# EAGLE design G228H (EAGLE 6.6.0)
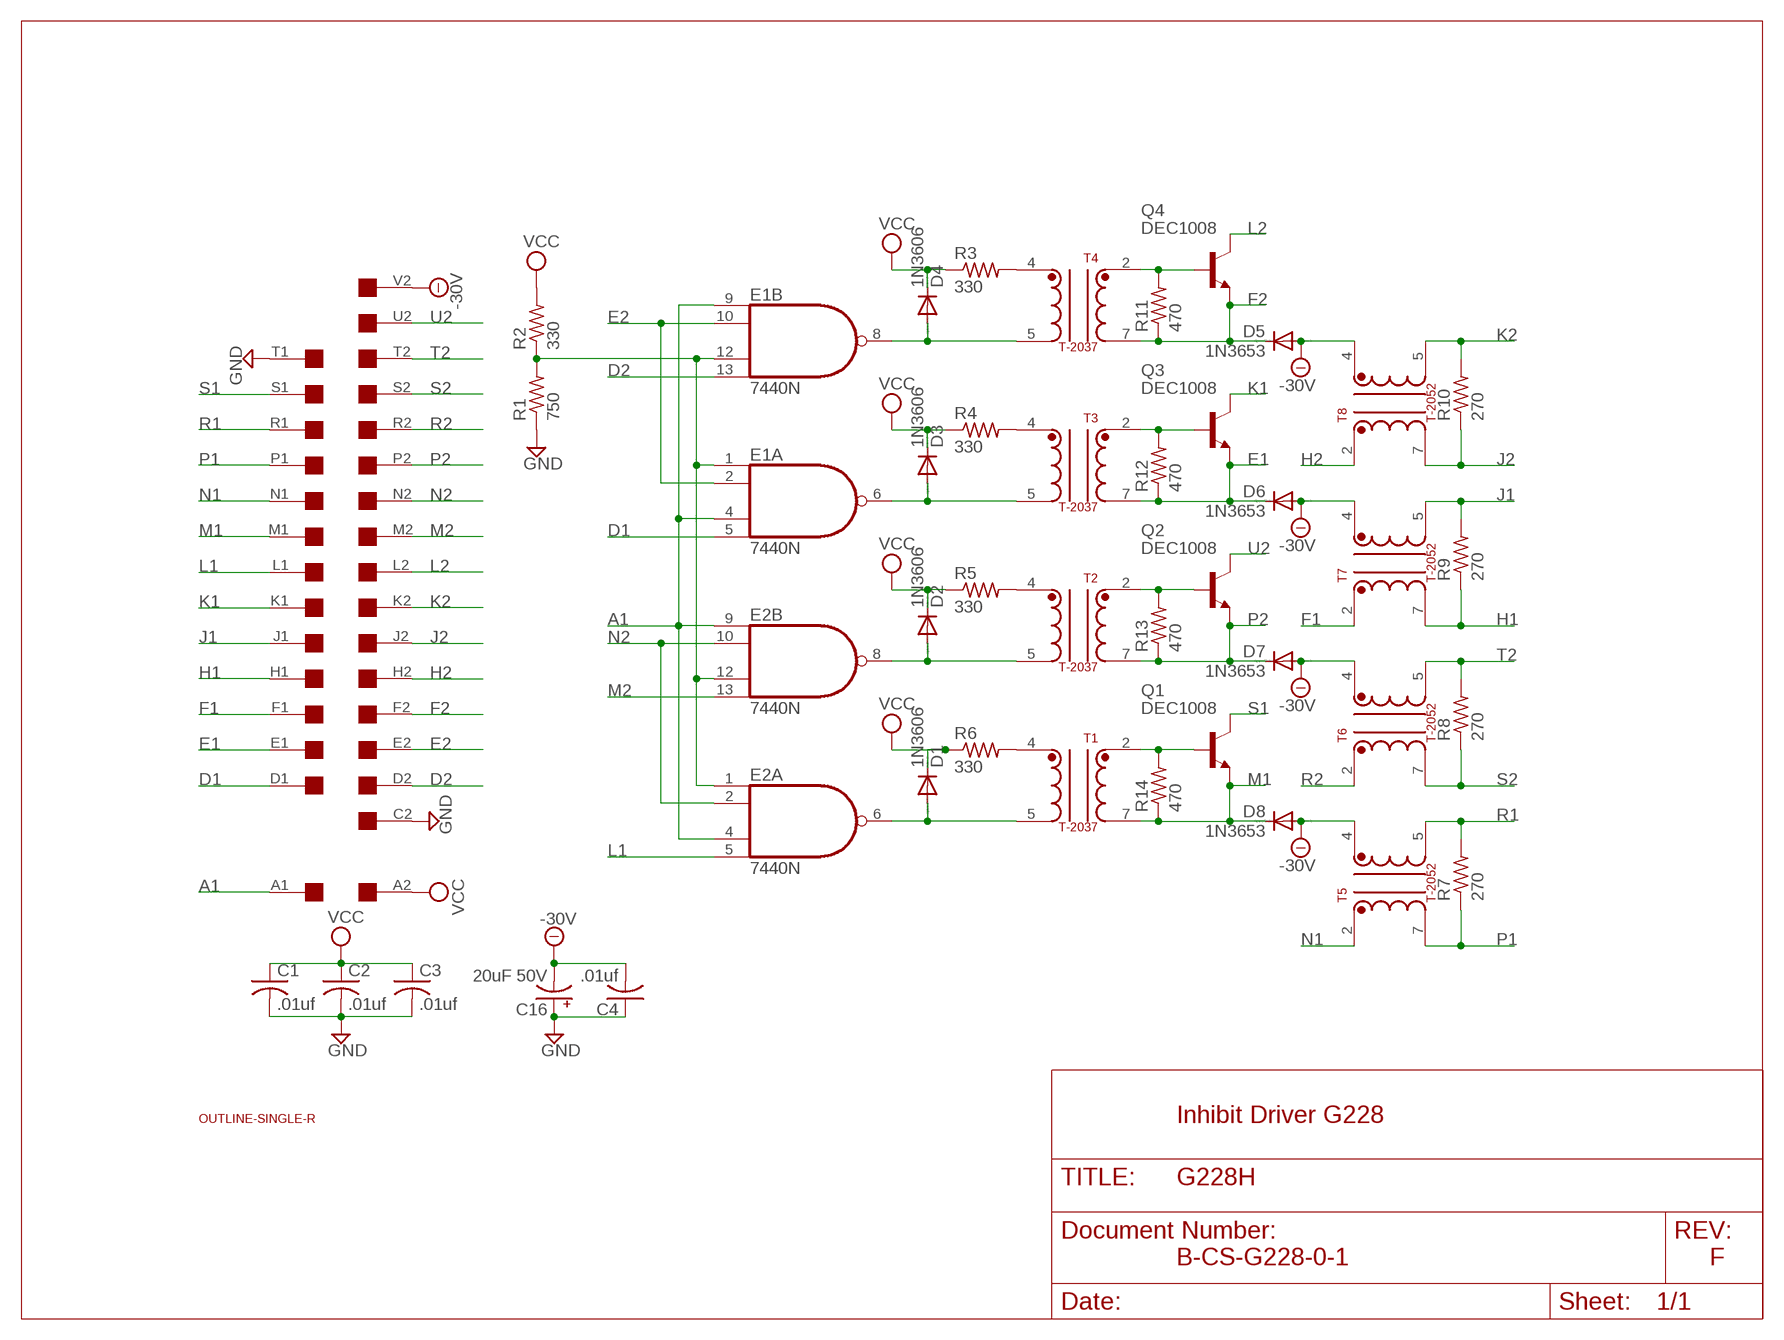
[diagram p0: schematic, sheet 1]

## Parts
C1  .01uf  C-US050-025X075  [C050-025X075]
C2  .01uf  C-US050-025X075  [C050-025X075]
C3  .01uf  C-US050-025X075  [C050-025X075]
C4  .01uf  C-US050-025X075  [C050-025X075]
C16  20uF 50V  CPOL-USE28-8AXIAL  [E28-8]
D1  1N3606  1N4148DO35-10  [DO35-10]
D2  1N3606  1N4148DO35-10  [DO35-10]
D3  1N3606  1N4148DO35-10  [DO35-10]
D4  1N3606  1N4148DO35-10  [DO35-10]
D5  1N3653  1N4148DO35-10  [DO35-10]
D6  1N3653  1N4148DO35-10  [DO35-10]
D7  1N3653  1N4148DO35-10  [DO35-10]
D8  1N3653  1N4148DO35-10  [DO35-10]
E1  7440N  74S20N  [DIL14]
E2  7440N  74S20N  [DIL14]
Q1  DEC1008  2N1613-NPN-TO39-EBC  [TO39]
Q2  DEC1008  2N1613-NPN-TO39-EBC  [TO39]
Q3  DEC1008  2N1613-NPN-TO39-EBC  [TO39]
Q4  DEC1008  2N1613-NPN-TO39-EBC  [TO39]
R1  750  R-US_0207/10  [0207/10]
R2  330  R-US_0207/10  [0207/10]
R3  330  R-US_0207/10  [0207/10]
R4  330  R-US_0207/10  [0207/10]
R5  330  R-US_0207/10  [0207/10]
R6  330  R-US_0207/10  [0207/10]
R7  270  R-US_0207/10  [0207/10]
R8  270  R-US_0207/10  [0207/10]
R9  270  R-US_0207/10  [0207/10]
R10  270  R-US_0207/10  [0207/10]
R11  470  R-US_0207/10  [0207/10]
R12  470  R-US_0207/10  [0207/10]
R13  470  R-US_0207/10  [0207/10]
R14  470  R-US_0207/10  [0207/10]
T1  T-2037  [TRANSFORMER]
T2  T-2037  [TRANSFORMER]
T3  T-2037  [TRANSFORMER]
T4  T-2037  [TRANSFORMER]
T5  T-2052  [TRANSFORMER]
T6  T-2052  [TRANSFORMER]
T7  T-2052  [TRANSFORMER]
T8  T-2052  [TRANSFORMER]
U$1  SINGLE  [EDGE-CON2]
U$2  OUTLINE-SINGLE-R  [SINGLE-R]

## Nets
-24V [supply]: C4.2 C16.- D5.A D6.A D7.A D8.A T5.4 T6.4 T7.4 T8.4 U$1.V2 ; supply symbol labelled -30V
A1: E1.4(A:I2) E1.9(B:I0) E2.4(A:I2) E2.9(B:I0) U$1.A1
D1: E1.5(A:I3) U$1.D1
D2: E1.13(B:I3) U$1.D2
E1: D6.C Q3.1(E) R12.1 T3.7 U$1.E1
E2: E1.2(A:I1) E1.10(B:I1) U$1.E2
F1: T7.2 U$1.F1
F2: D5.C Q4.1(E) R11.1 T4.7 U$1.F2
GND [supply]: C1.2 C2.2 C3.2 C4.1 C16.+ R1.1 U$1.C2 U$1.T1
H1: R9.1 T7.7 U$1.H1
H2: T8.2 U$1.H2
J1: R9.2 T7.5 U$1.J1
J2: R10.1 T8.7 U$1.J2
K1: Q3.3(C) U$1.K1
K2: R10.2 T8.5 U$1.K2
L1: E2.5(A:I3) U$1.L1
L2: Q4.3(C) U$1.L2
M1: D8.C Q1.1(E) R14.1 T1.7 U$1.M1
M2: E2.13(B:I3) U$1.M2
N1: T5.2 U$1.N1
N2: E2.2(A:I1) E2.10(B:I1) U$1.N2
N$1: E1.1(A:I0) E1.12(B:I2) E2.1(A:I0) E2.12(B:I2) R1.2 R2.1
N$2: D1.A E2.6(A:O) T1.5
N$3: D2.A E2.8(B:O) T2.5
N$4: D3.A E1.6(A:O) T3.5
N$5: D4.A E1.8(B:O) T4.5
N$6: R6.2 T1.4
N$7: R5.2 T2.4
N$8: R4.2 T3.4
N$9: R3.2 T4.4
N$10: Q4.2(B) R11.2 T4.2
N$12: Q3.2(B) R12.2 T3.2
N$14: Q2.2(B) R13.2 T2.2
N$16: Q1.2(B) R14.2 T1.2
P1: R7.1 T5.7 U$1.P1
P2: D7.C Q2.1(E) R13.1 T2.7 U$1.P2
R1: R7.2 T5.5 U$1.R1
R2: T6.2 U$1.R2
S1: Q1.3(C) U$1.S1
S2: R8.1 T6.7 U$1.S2
T2: R8.2 T6.5 U$1.T2
U2: Q2.3(C) U$1.U2
VCC [supply]: C1.1 C2.1 C3.1 D1.C D2.C D3.C D4.C R2.2 R3.1 R4.1 R5.1 R6.1 U$1.A2
Unconnected: U$1.B1 U$1.B2 U$1.C1 U$1.U1 U$1.V1

## Notes on the sheet
- Inhibit Driver G228
- B-CS-G228-0-1 | F

## Power pins joined to a net without a drawn wire
GND: E1.7(P:GND) E2.7(P:GND)
VCC: E1.14(P:VCC) E2.14(P:VCC)

## Library data of the parts
C1-C4 = rcl:C-US: CAPACITOR, American symbol
C16 = dec-con:CPOL-USE28-8AXIAL: Large Electrolytic, grin 1.1"
D1-D8 = diode:1N4148: DIODE high speed (Philips)
E1 E2 = 74xx-us:74*20: Dual 4-input NAND gate
Q1-Q4 = transistor:*-NPN-: NPN Transistror BF959 corrected 2008.03.06
R1-R14 = rcl:R-US_: RESISTOR, American symbol
T1-T4 = dec-con:T-2037: T-2037 Transformer
T5-T8 = dec-con:T-2052: T-2052 Transformer
U$1 = dec-con:SINGLE: Single-Height DEC board
U$2 = dec-con:OUTLINE-*: Board outlines for DEC boards.

## Net classes
1 supply: width 0.813 mm

## Board
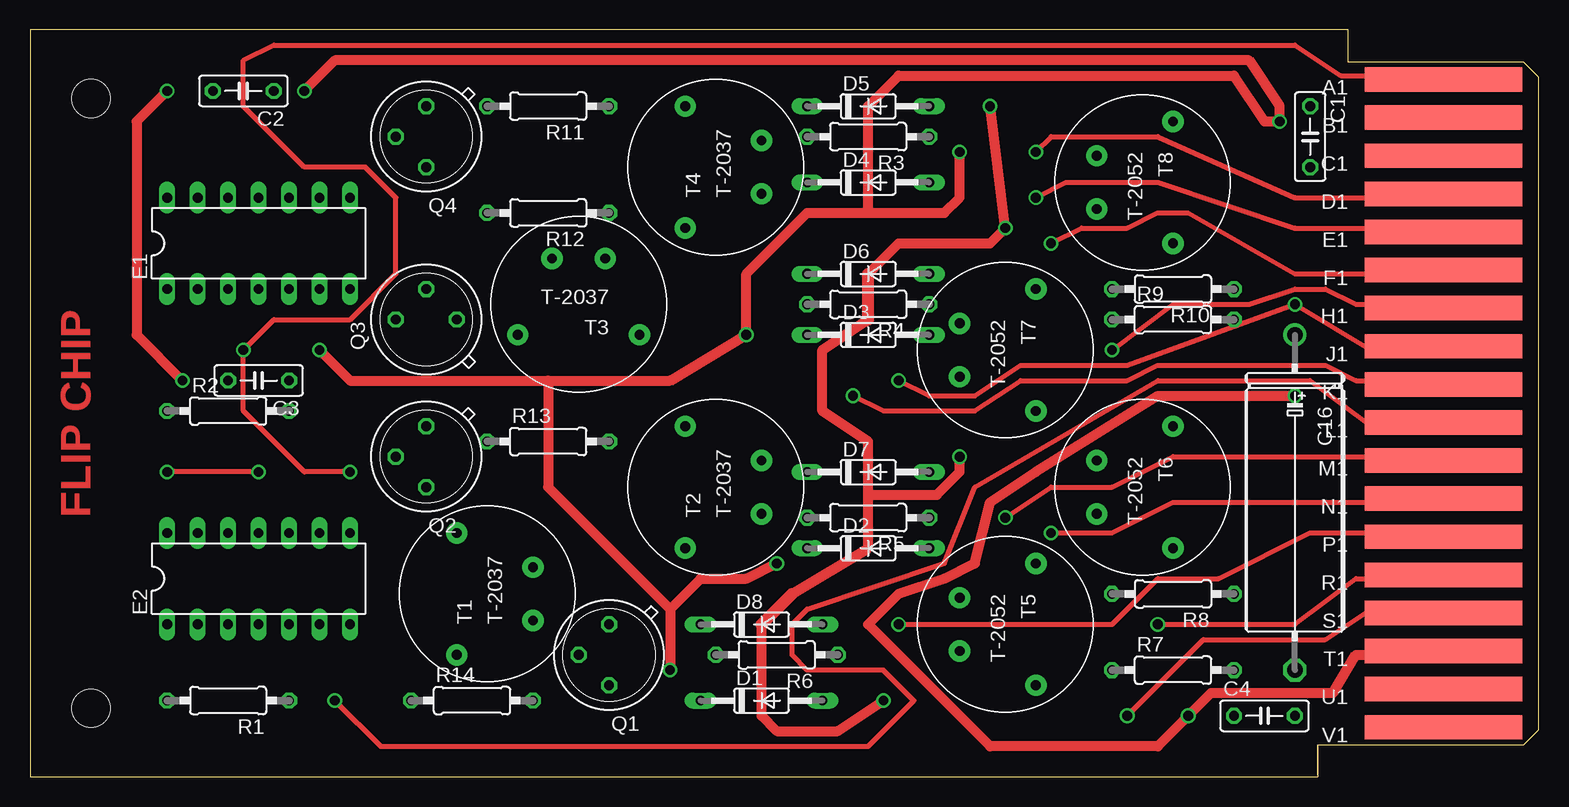
[diagram p1: board, top side]
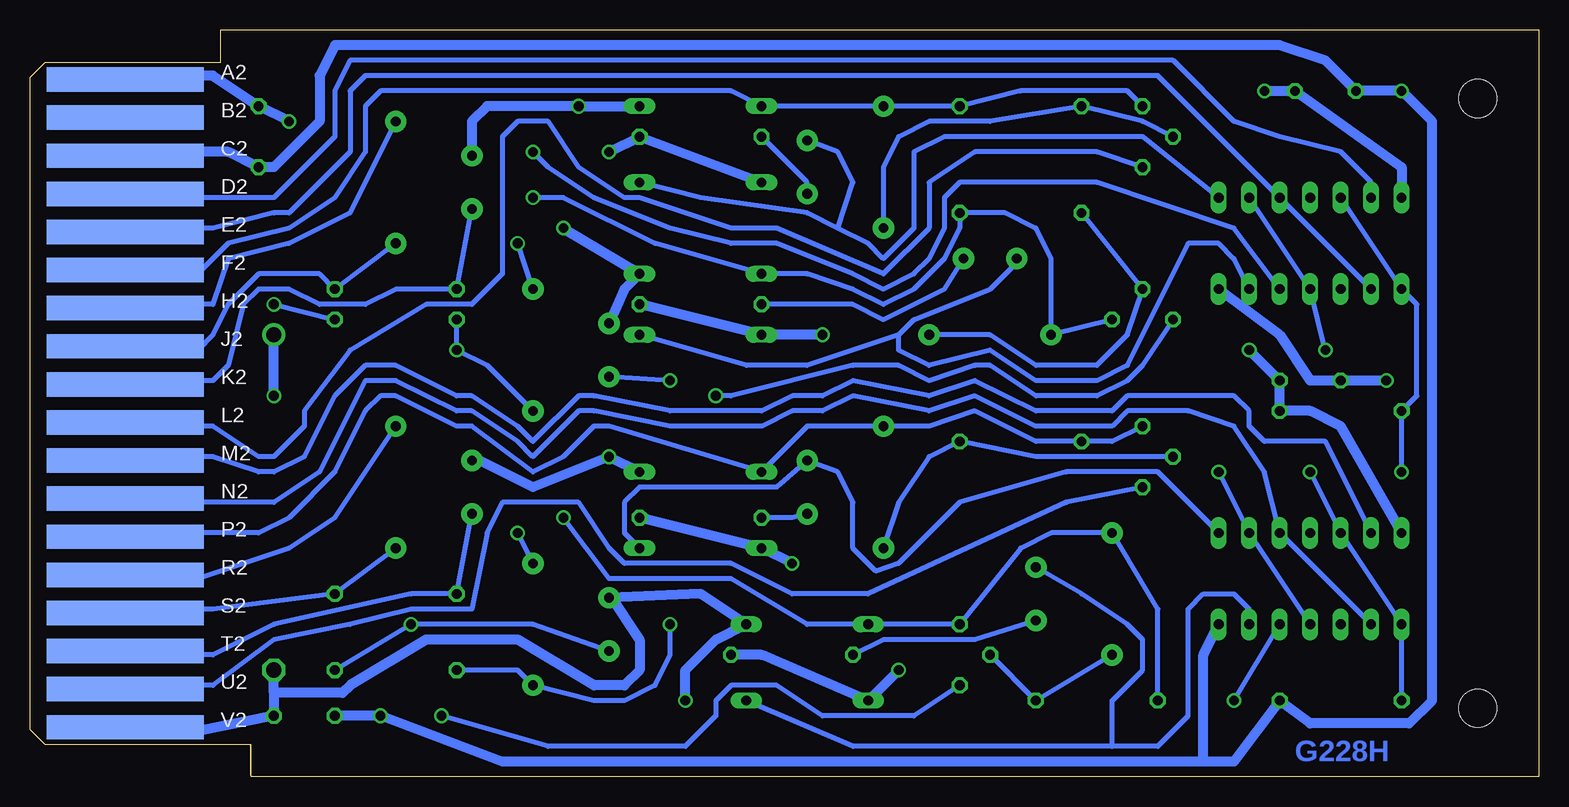
[diagram p2: board, bottom side, seen from below]

Size 125.73 x 62.23 mm. Coordinates in mm from the lower left corner, seen from the top.
Copper layers (1+16): Top 0.035mm / dielectric 1.5mm / Bottom 0.035mm
Design rules "16mils": minimum track width 16mil, minimum drill 32mil, track to track 15mil, track to pad 10mil, pad to pad 10mil, via to via 10mil, smd to smd 10mil, copper to edge 13mil, drill to drill 10mil, minimum pad ring 10mil, minimum via ring 8mil, stop-mask expansion 0mil, vias tented up to drill 0mil, thermal gap 10mil

### Footprints (pad centres in the part's own frame; a part is rotated, then mirrored left to right if it is on the bottom)
C050-025X075 = drill 0.813 octagon: 1 -2.54,0; 2 2.54,0
E28-8 = drill 1.27: + -13.97,0 | drill 1.27 octagon: - 13.97,0
DO35-10 = drill 0.813 long: A 5.08,0; C -5.08,0
DIL14 = drill 0.813 long: 1 -7.62,-3.81; 2 -5.08,-3.81; 3 -2.54,-3.81; 4 0,-3.81; 5 2.54,-3.81; 6 5.08,-3.81; 7 7.62,-3.81; 8 7.62,3.81; 9 5.08,3.81; 10 2.54,3.81; 11 0,3.81; 12 -2.54,3.81; 13 -5.08,3.81; 14 -7.62,3.81
TO39 = drill 0.813 octagon: 1 0,-2.54; 2 2.54,0; 3 0,2.54
0207/10 = drill 0.813 octagon: 1 -5.08,0; 2 5.08,0
TRANSFORMER = drill 0.813 pad 1.778: 2 -5.08,2.54; 4 -2.223,-3.81; 5 2.223,-3.81; 7 5.08,2.54
EDGE-CON2 = smd 13.106 x 2.032: A1 7.938,4.128; B1 7.938,7.303; C1 7.938,10.477; D1 7.938,13.652; E1 7.938,16.828; F1 7.938,20.003; H1 7.938,23.177; J1 7.938,26.352; K1 7.938,29.527; L1 7.938,32.703; M1 7.938,35.877; N1 7.938,39.053; P1 7.938,42.227; R1 7.938,45.403; S1 7.938,48.578; T1 7.938,51.752; U1 7.938,54.928; V1 7.938,58.102 | smd 13.106 x 2.032 bottom: A2 7.938,4.128; B2 7.938,7.303; C2 7.938,10.477; D2 7.938,13.652; E2 7.938,16.828; F2 7.938,20.003; H2 7.938,23.177; J2 7.938,26.352; K2 7.938,29.527; L2 7.938,32.703; M2 7.938,35.877; N2 7.938,39.053; P2 7.938,42.227; R2 7.938,45.403; S2 7.938,48.578; T2 7.938,51.752; U2 7.938,54.928; V2 7.938,58.102
SINGLE-R = hole 3.175: 5.08,5.715; 5.08,56.515

### Placement (x,y rotation side)
C1  106.68,53.34 270 top
C2  17.78,57.15 180 top
C3  19.05,33.02 180 top
C4  102.87,5.08 0 top
C16  105.41,22.86 270 top
D1  60.96,6.35 0 top
D2  69.85,19.05 0 top
D3  69.85,36.83 0 top
D4  69.85,49.53 0 top
D5  69.85,55.88 0 top
D6  69.85,41.91 0 top
D7  69.85,25.4 0 top
D8  60.96,12.7 0 top
E1  19.05,44.45 0 top
E2  19.05,16.51 0 top
Q1  48.26,10.16 180 top
Q2  33.02,26.67 180 top
Q3  33.02,38.1 90 top
Q4  33.02,53.34 180 top
R1  16.51,6.35 180 top
R2  16.51,30.48 0 top
R3  69.85,53.34 180 top
R4  69.85,39.37 180 top
R5  69.85,21.59 180 top
R6  62.23,10.16 180 top
R7  95.25,8.89 0 top
R8  95.25,15.24 180 top
R9  95.25,38.1 0 top
R10  95.25,40.64 180 top
R11  43.18,55.88 180 top
R12  43.18,46.99 180 top
R13  43.18,27.94 0 top
R14  36.83,6.35 0 top
T1  38.1,15.24 90 top
T2  57.15,24.13 90 top
T3  45.72,39.37 180 top
T4  57.15,50.8 90 top
T5  81.28,12.7 270 top
T6  92.71,24.13 270 top
T7  81.28,35.56 270 top
T8  92.71,49.53 270 top
U$1  125.73,62.23 180 top
U$2  0,0 0 top

### Tracks (layer width: path | path; a pad name or v marks a point on that pad's centre or on a via)
-24V  (via drill 0.81)
  Top 0.813: v80.01,55.88 v81.28,45.72 80.01,44.45 72.39,44.45 69.85,41.91 | v71.12,6.35 67.31,3.81 62.23,3.81 60.96,5.08 60.96,12.7 | 63.5,15.24 69.85,19.05 69.85,23.5 | 69.85,23.5 69.85,27.94 66.04,30.48 66.04,35.56 69.85,38.1 | v77.47,26.67 77.47,25.4 75.56,23.5 69.85,23.5
  Top 1.016: 60.96,12.7 63.5,15.24 | 69.85,38.1 69.85,41.91
  Bottom 0.813: U$1.V2 115.57,3.81 111.76,3.81 C4.2 105.41,6.99 | 105.41,6.99 C16.- | 105.41,6.99 99.69,6.99 99.06,7.62 92.71,11.43 85.09,11.43 78.74,7.62 76.2,7.62 74.93,8.89 74.93,11.43 77.47,15.24 T5.4 69.85,15.24 D8.A 68.58,11.43 71.12,8.89 v71.12,6.35 | D5.A v80.01,55.88 87.63,55.88 88.9,54.61 T8.4 | T7.4 76.2,40.64 D6.A v81.28,45.72 | D7.A v77.47,26.67 83.82,24.13 88.9,26.67 T6.4
A1  (via drill 0.81)
  Top 0.406: U$1.A1 115.57,58.42 109.22,58.42 105.41,60.96 20.32,60.96 17.78,59.69 17.78,55.88 22.86,50.8 27.94,50.8 30.48,48.26 30.48,41.91 26.67,38.1 20.32,38.1 v17.78,35.56 17.78,30.48 22.86,25.4 v26.67,25.4
  Bottom 0.406: E2.4 E2.9 v26.67,25.4 | v17.78,35.56 E1.4 E1.9
D1  (via drill 0.81)
  Top 0.406: U$1.D1 115.57,48.26 105.41,48.26 93.98,53.34 85.09,53.34 v83.82,52.07
  Bottom 0.406: E1.5 25.4,45.72 36.83,49.53 48.26,49.53 49.53,48.26 49.53,45.72 50.8,43.18 52.07,41.91 54.61,40.64 57.15,41.91 63.5,44.45 67.31,44.45 72.39,45.72 78.74,48.26 82.55,50.8 v83.82,52.07
D2
  Bottom 0.406: E1.13 13.97,49.53 16.51,52.07 21.59,53.34 25.4,54.61 30.48,59.69 99.06,59.69 100.33,57.15 100.33,53.34 105.41,48.26 115.57,48.26 U$1.D2
E1  (via drill 0.81)
  Top 0.406: v83.82,48.26 86.36,49.53 93.98,49.53 105.41,45.72 115.57,45.72 U$1.E1
  Bottom 0.406: Q3.1 T3.7 40.64,43.18 41.91,45.72 44.45,46.99 R12.1 48.26,45.72 49.53,43.18 52.07,40.64 54.61,39.37 57.15,40.64 60.96,41.91 D6.C 73.66,44.45 81.28,48.26 v83.82,48.26
E2
  Bottom 0.406: E1.2 E1.10 31.75,58.42 97.79,58.42 99.06,57.15 99.06,52.07 104.14,46.99 105.41,46.99 110.49,45.72 116.84,45.72 U$1.E2
F1  (via drill 0.81)
  Top 0.406: v85.09,44.45 87.63,45.72 91.44,45.72 93.98,46.99 96.52,46.99 105.41,41.91 116.84,41.91 U$1.F1
  Bottom 0.406: T7.2 v85.09,44.45
F2
  Bottom 0.406: Q4.1 34.29,57.15 43.18,57.15 R11.1 T4.7 D5.C 67.31,57.15 96.52,57.15 97.79,55.88 97.79,52.07 100.33,48.26 104.14,45.72 109.22,44.45 111.76,41.91 115.57,41.91 U$1.F2
GND  (via drill 0.81)
  Top 0.813: v12.7,33.02 8.89,36.83 8.89,54.61 v11.43,57.15 | U$1.T1 116.84,10.16 110.49,10.16 108.58,6.99 98.42,6.99 v96.52,5.08 93.98,2.54 80.01,2.54 69.85,12.7 72.39,15.24 76.2,16.51 78.74,17.78 80.01,22.86 83.82,25.4 93.98,31.75 v105.41,31.75
  Bottom 0.813: C4.1 v96.52,5.08 86.36,1.27 27.94,1.27 | 27.94,1.27 25.4,1.27 R1.1 19.05,4.45 10.79,4.45 8.89,6.35 8.89,54.61 v11.43,57.15 C2.2 17.78,59.69 21.59,60.96 100.33,60.96 101.6,58.42 101.6,54.61 105.41,50.8 C1.2 109.22,52.07 116.84,52.07 U$1.C2 | E2.7 27.94,10.16 27.94,1.27 | E1.7 21.59,36.83 19.05,33.02 C3.2 v12.7,33.02 | v105.41,31.75 C16.+
H1  (via drill 0.81)
  Top 0.406: U$1.H1 115.57,39.37 110.49,39.37 107.95,40.64 105.41,40.64 101.6,39.37 95.25,39.37 v90.17,35.56
  Bottom 0.406: T7.7 87.63,34.29 v90.17,35.56 R9.1
H2
  Bottom 0.406: U$1.H2 116.84,39.37 110.49,39.37 109.22,43.18 104.14,44.45 99.06,46.99 T8.2
J1  (via drill 0.81)
  Top 0.406: U$1.J1 116.84,35.56 111.76,35.56 v105.41,39.37 91.44,34.29 82.55,34.29 78.74,31.75 74.93,31.75 v72.39,33.02
  Bottom 0.406: v72.39,33.02 T7.5 | v105.41,39.37 R9.2
J2
  Bottom 0.406: U$1.J2 116.84,35.56 111.76,35.56 110.49,36.83 109.22,39.37 106.68,41.91 101.6,41.91 R10.1 T8.7
K1  (via drill 0.81)
  Top 0.406: v68.58,31.75 71.12,30.48 78.74,30.48 82.55,33.02 91.44,33.02 93.98,34.29 107.95,34.29 110.49,33.02 115.57,33.02 U$1.K1
  Bottom 0.406: Q3.3 33.02,34.29 34.29,33.02 36.83,31.75 41.91,31.75 45.72,34.29 46.99,34.29 50.8,33.02 53.34,34.29 57.15,34.29 67.31,31.75 v68.58,31.75
K2
  Bottom 0.406: T8.5 R10.2 95.25,40.64 97.79,39.37 101.6,39.37 104.14,40.64 106.68,40.64 107.95,39.37 109.22,34.29 110.49,33.02 115.57,33.02 U$1.K2
L1  (via drill 0.81)
  Top 0.406: v25.4,6.35 29.21,2.54 69.85,2.54 73.66,6.35 71.12,8.89 64.77,8.89 63.5,10.16 63.5,12.7 64.77,13.97 76.2,17.78 78.74,24.13 93.98,33.02 106.68,33.02 111.76,29.21 116.84,29.21 U$1.L1
  Bottom 0.406: v25.4,6.35 E2.5
L2
  Bottom 0.406: Q4.3 36.83,52.07 46.99,52.07 50.8,49.53 50.8,45.72 54.61,41.91 63.5,45.72 67.31,45.72 74.93,48.26 76.2,48.26 80.01,50.8 82.55,54.61 85.09,54.61 86.36,53.34 86.36,41.91 88.9,39.37 92.71,39.37 99.06,35.56 102.87,30.48 102.87,29.21 105.41,26.67 106.68,26.67 110.49,29.21 116.84,29.21 U$1.L2
M1  (via drill 0.81)
  Top 0.406: U$1.M1 115.57,26.67 95.25,26.67 90.17,24.13 85.09,24.13 v81.28,21.59
  Bottom 0.406: R14.1 31.75,13.97 T1.7 40.64,20.32 43.18,19.05 Q1.1 D8.C 60.96,12.7 67.31,16.51 77.47,16.51 v81.28,21.59
M2
  Bottom 0.406: E2.13 17.78,27.94 22.86,27.94 24.13,29.21 24.13,30.48 25.4,31.75 34.29,31.75 35.56,30.48 41.91,30.48 46.99,33.02 50.8,31.75 57.15,33.02 59.69,31.75 62.23,31.75 64.77,30.48 72.39,30.48 78.74,31.75 80.01,31.75 83.82,27.94 85.09,29.21 88.9,31.75 90.17,31.75 95.25,34.29 97.79,34.29 100.33,31.75 102.87,26.67 105.41,25.4 106.68,25.4 110.49,26.67 115.57,26.67 U$1.M2
N1  (via drill 0.81)
  Top 0.406: v85.09,20.32 90.17,20.32 95.25,22.86 116.84,22.86 U$1.N1
  Bottom 0.406: T5.2 v85.09,20.32
N2
  Bottom 0.406: E2.2 E2.10 22.86,25.4 25.4,29.21 29.21,30.48 34.29,30.48 35.56,29.21 41.91,29.21 46.99,31.75 50.8,30.48 57.15,31.75 59.69,30.48 62.23,30.48 64.77,29.21 72.39,29.21 78.74,30.48 80.01,30.48 83.82,26.67 85.09,27.94 88.9,30.48 90.17,30.48 95.25,33.02 97.79,33.02 101.6,25.4 105.41,22.86 115.57,22.86 U$1.N2
N$1  (via drill 0.81)
  Top 0.406: v19.05,25.4 v11.43,25.4
  Bottom 0.406: R1.2 E2.1 E2.12 v19.05,25.4 | v11.43,25.4 R2.1 10.16,31.75 10.16,39.37 E1.1 E1.12
N$2
  Bottom 0.406: E2.6 24.13,13.97 25.4,15.24 27.94,15.24 29.21,13.97 29.21,5.08 31.75,2.54 35.56,2.54 | 35.56,2.54 57.15,2.54 D1.A | T1.5 38.1,15.24 34.29,12.7 33.02,11.43 33.02,8.89 35.56,6.35 35.56,2.54
N$3
  Bottom 0.406: E2.8 31.75,25.4 39.37,25.4 48.26,22.86 53.34,17.78 55.24,17.14 57.15,19.05 57.15,22.86 58.42,25.4 T2.5 63.5,24.13 74.93,24.13 76.2,22.86 76.2,20.32 D2.A
N$4
  Bottom 0.406: E1.6 25.4,43.18 26.67,44.45 29.21,44.45 34.29,34.29 36.83,33.02 41.91,33.02 45.72,35.56 50.8,34.29 53.34,35.56 53.34,36.83 | T3.5 43.18,43.18 45.72,40.64 52.07,38.1 53.34,36.83 | 53.34,36.83 60.96,34.29 66.04,34.29 D3.A
N$5
  Bottom 0.406: E1.8 33.02,53.34 49.53,53.34 52.07,52.07 52.07,45.72 54.61,43.18 55.88,44.45 58.42,45.72 | 58.42,45.72 60.96,46.99 69.85,48.26 D4.A | T4.5 58.42,52.07 57.15,49.53 58.42,45.72
N$6
  Bottom 0.406: T1.4 46.99,11.43 54.61,11.43 R6.2
N$7
  Bottom 0.406: T2.4 62.23,21.59 R5.2
N$8
  Bottom 0.406: T3.4 49.53,40.64 54.61,38.1 57.15,39.37 R4.2
N$9
  Bottom 0.406: T4.4 60.96,49.53 R3.2
N$10
  Bottom 0.406: Q4.2 33.02,54.61 R11.2 45.72,54.61 50.8,54.61 53.34,53.34 54.61,50.8 T4.2
N$12
  Bottom 0.406: R12.2 Q3.2 34.29,36.83 36.83,34.29 41.91,34.29 45.72,36.83 T3.2
N$14
  Bottom 0.406: Q2.2 41.91,26.67 R13.2 50.8,26.67 53.34,22.86 T2.2
N$16
  Bottom 0.406: Q1.2 R14.2 T1.2
P1  (via drill 0.81)
  Top 0.406: U$1.P1 116.84,20.32 106.68,20.32 99.06,16.51 93.98,16.51 90.17,12.7 v72.39,12.7
  Bottom 0.406: v72.39,12.7 72.39,10.16 73.66,7.62 76.2,6.35 78.74,6.35 T5.7 85.09,8.89 R7.1
P2
  Bottom 0.406: Q2.1 35.56,27.94 R13.1 41.91,27.94 46.99,30.48 50.8,29.21 T2.7 60.96,29.21 D7.C 77.47,29.21 78.74,29.21 81.28,26.67 83.82,25.4 88.9,29.21 90.17,29.21 95.25,31.75 96.52,31.75 97.79,30.48 100.33,25.4 104.14,21.59 106.68,20.32 114.3,20.32 U$1.P2
R1  (via drill 0.81)
  Top 0.406: U$1.R1 115.57,16.51 110.49,16.51 105.41,12.7 v93.98,12.7
  Bottom 0.406: T5.5 83.82,12.7 v93.98,12.7 R7.2
R2
  Bottom 0.406: U$1.R2 115.57,16.51 111.76,16.51 104.14,19.05 100.33,21.59 T6.2
S1  (via drill 0.81)
  Top 0.406: v91.44,5.08 97.79,11.43 107.95,11.43 111.76,13.97 115.57,13.97 U$1.S1
  Bottom 0.406: Q1.3 52.07,5.08 59.69,5.08 63.5,7.62 67.31,7.62 68.58,6.35 68.58,5.08 71.12,2.54 82.55,2.54 v91.44,5.08
S2
  Bottom 0.406: T6.7 R8.1 110.49,13.97 115.57,13.97 U$1.S2
T2
  Bottom 0.406: U$1.T2 115.57,10.16 110.49,10.16 105.41,12.7 93.98,15.24 R8.2 T6.5
U2
  Bottom 0.406: U$1.U2 115.57,7.62 110.49,7.62 105.41,11.43 99.06,12.7 93.98,13.97 88.9,13.97 87.63,20.32 86.36,22.86 80.01,22.86 77.47,19.05 76.2,17.78 67.31,17.78 62.23,15.24 55.88,15.24 39.37,22.86 Q2.3
VCC  (via drill 0.81)
  Top 0.813: v24.13,35.56 26.67,33.02 43.18,33.02 | 43.18,33.02 53.34,33.02 v59.69,36.83 59.69,41.91 64.77,46.99 69.85,46.99 | v77.47,52.07 77.47,48.26 76.2,46.99 69.85,46.99 | 69.85,46.99 69.85,55.88 72.39,58.42 100.33,58.42 102.87,54.61 v104.14,54.61 104.14,55.88 101.6,59.69 25.4,59.69 v22.86,57.15 | v62.23,17.78 59.69,16.51 55.88,16.51 53.34,13.97 | 53.34,13.97 v53.34,8.89 | 53.34,13.97 43.18,24.13 43.18,33.02
  Bottom 0.813: E2.14 16.51,29.21 19.05,30.48 R2.2 C3.1 v24.13,35.56 | E1.14 11.43,50.8 C2.1 v22.86,57.15 | U$1.A2 116.84,58.42 110.49,58.42 C1.1 v104.14,54.61 | R5.1 D2.C v62.23,17.78 | v53.34,8.89 D1.C 64.77,10.16 R6.1 | v77.47,52.07 R3.1 D4.C | R4.1 D3.C v59.69,36.83

### Text on the board
Top: FLIP CHIP
Bottom: G228H